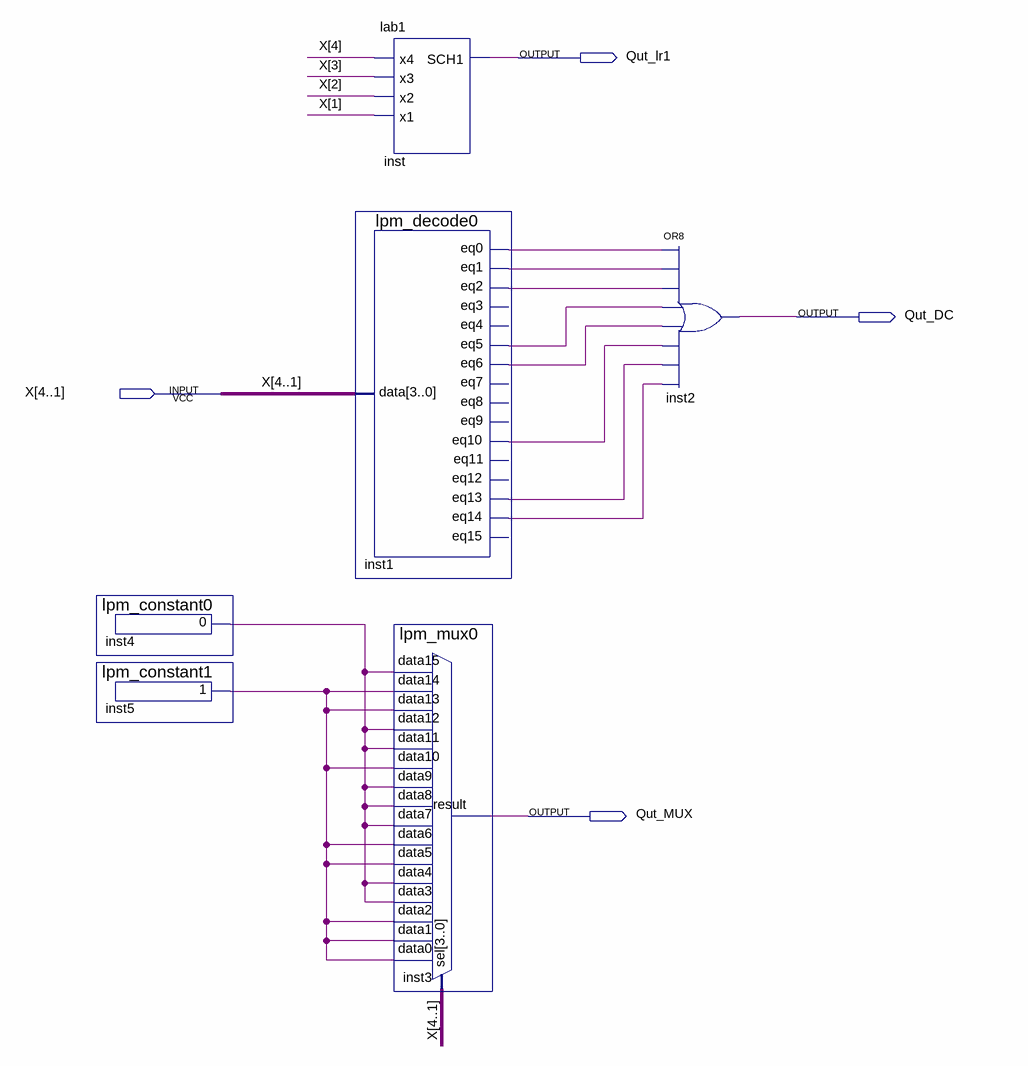
[diagram p0: schematic sheet]
// Quartus schematic lab2.bdf as structural Verilog: 6 symbols, 4 pins
module lab2 (
  input  [4:1] X,
  output Qut_lr1,
  output Qut_DC,
  output Qut_MUX
);

  wire inst1_eq0, inst1_eq1, inst1_eq2, inst1_eq5, inst1_eq6, inst1_eq10, inst1_eq13, inst1_eq14,
       inst4_result, inst5_result;

  lpm_constant0 inst4 (.result(inst4_result));
  lpm_constant1 inst5 (.result(inst5_result));
  lab1 inst (.x4(X[4]), .x3(X[3]), .x2(X[2]), .x1(X[1]), .SCH1(Qut_lr1));
  lpm_decode0 inst1 (
    .data(X), .eq0(inst1_eq0), .eq1(inst1_eq1), .eq2(inst1_eq2), .eq5(inst1_eq5), .eq6(inst1_eq6),
    .eq10(inst1_eq10), .eq13(inst1_eq13), .eq14(inst1_eq14));  // open: eq3, eq4, eq7, eq8, eq9, eq11, eq12, eq15
  lpm_mux0 inst3 (
    .data15(inst4_result), .data14(inst5_result), .data13(inst5_result), .data12(inst4_result),
    .data11(inst4_result), .data10(inst5_result), .data9(inst4_result), .data8(inst4_result),
    .data7(inst4_result), .data6(inst5_result), .data5(inst5_result), .data4(inst4_result),
    .data3(inst4_result), .data2(inst5_result), .data1(inst5_result), .data0(inst5_result), .sel(X),
    .result(Qut_MUX));
  or inst2 (Qut_DC, inst1_eq0, inst1_eq1, inst1_eq2, inst1_eq5, inst1_eq6, inst1_eq10, inst1_eq13, inst1_eq14);
endmodule
